# Altium project BlueSat_FlatSat.PrjPCB (part 1 of 2)
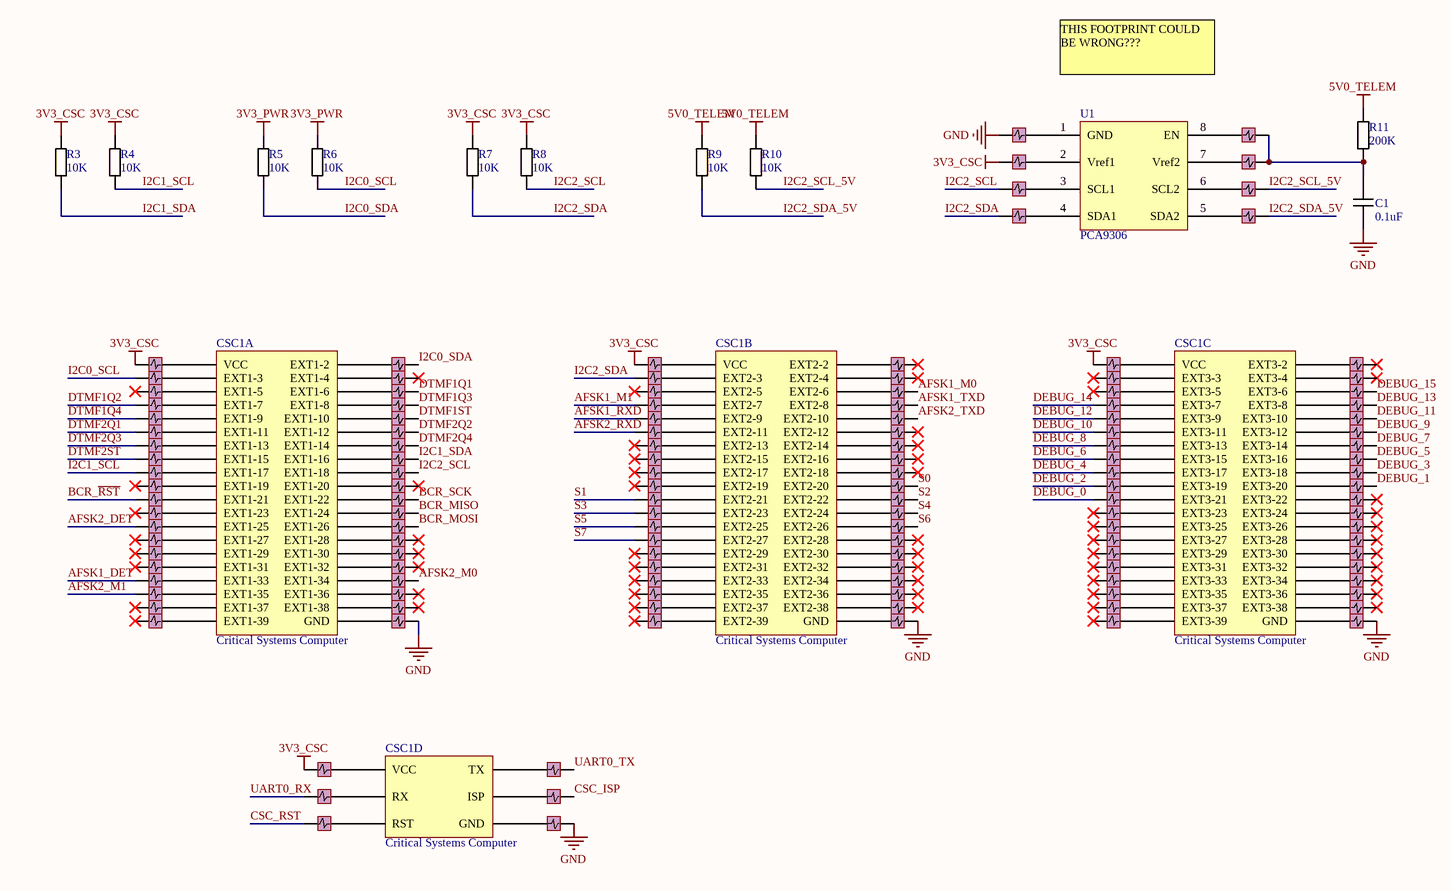
[diagram p0: CRSC0006 CSC Footprint.SchDoc]
3 sheets, 395 parts. Net scope: global (net labels, ports and power ports of the same name join across sheets).
Board files: GENN0007 Flatsat.PcbDoc, CRSC0006 CSC Footprint.PcbDoc, PAYL0007 Beaglebone Footprint.PcbDoc, COMS0007 Communicaitons Footprint.PcbDoc, POWR0011 Regulator Footprints.PcbDoc, POWR0010 BCR and Solar Footprints.PcbDoc
Sheets:
  CRSC0006 CSC Footprint.SchDoc
  COMS0011 Communications Footprints.SchDoc
  GENN0006 LED_INDICATORS.SchDoc

## Sheet CRSC0006 CSC Footprint.SchDoc: Flatsat CSC Footprint
size A3; Engineer: A. Shaw, E. Nafis, C. Brown; DocumentNumber: CRSC0006; SheetNumber: 1; SheetTotal: 6; Description: Critical Systems Computer footprint for Flatsat; Version: 1.0

### Parts
C1  value 0.1uF  [6-0805_M]  (hidden comment: 0805 Cap)
CSC1  Critical Systems Computer  [CSC]  (parts A,B,C,D of 4)
P203  Jumper_Filter  [Jumper_filter]  (value not drawn)
P204  Jumper_Filter  [Jumper_filter]  (value not drawn)
P205  Jumper_Filter  [Jumper_filter]  (value not drawn)
P206  Jumper_Filter  [Jumper_filter]  (value not drawn)
P207  Jumper_Filter  [Jumper_filter]  (value not drawn)
P208  Jumper_Filter  [Jumper_filter]  (value not drawn)
P209  Jumper_Filter  [Jumper_filter]  (value not drawn)
P210  Jumper_Filter  [Jumper_filter]  (value not drawn)
P211  Jumper_Filter  [Jumper_filter]  (value not drawn)
P212  Jumper_Filter  [Jumper_filter]  (value not drawn)
P213  Jumper_Filter  [Jumper_filter]  (value not drawn)
P214  Jumper_Filter  [Jumper_filter]  (value not drawn)
P215  Jumper_Filter  [Jumper_filter]  (value not drawn)
P216  Jumper_Filter  [Jumper_filter]  (value not drawn)
P217  Jumper_Filter  [Jumper_filter]  (value not drawn)
P218  Jumper_Filter  [Jumper_filter]  (value not drawn)
P219  Jumper_Filter  [Jumper_filter]  (value not drawn)
P220  Jumper_Filter  [Jumper_filter]  (value not drawn)
P221  Jumper_Filter  [Jumper_filter]  (value not drawn)
P222  Jumper_Filter  [Jumper_filter]  (value not drawn)
P223  Jumper_Filter  [Jumper_filter]  (value not drawn)
P224  Jumper_Filter  [Jumper_filter]  (value not drawn)
P225  Jumper_Filter  [Jumper_filter]  (value not drawn)
P226  Jumper_Filter  [Jumper_filter]  (value not drawn)
P227  Jumper_Filter  [Jumper_filter]  (value not drawn)
P228  Jumper_Filter  [Jumper_filter]  (value not drawn)
P229  Jumper_Filter  [Jumper_filter]  (value not drawn)
P230  Jumper_Filter  [Jumper_filter]  (value not drawn)
P231  Jumper_Filter  [Jumper_filter]  (value not drawn)
P232  Jumper_Filter  [Jumper_filter]  (value not drawn)
P233  Jumper_Filter  [Jumper_filter]  (value not drawn)
P234  Jumper_Filter  [Jumper_filter]  (value not drawn)
P235  Jumper_Filter  [Jumper_filter]  (value not drawn)
P236  Jumper_Filter  [Jumper_filter]  (value not drawn)
P237  Jumper_Filter  [Jumper_filter]  (value not drawn)
P238  Jumper_Filter  [Jumper_filter]  (value not drawn)
P239  Jumper_Filter  [Jumper_filter]  (value not drawn)
P240  Jumper_Filter  [Jumper_filter]  (value not drawn)
P241  Jumper_Filter  [Jumper_filter]  (value not drawn)
P242  Jumper_Filter  [Jumper_filter]  (value not drawn)
P243  Jumper_Filter  [Jumper_filter]  (value not drawn)
P244  Jumper_Filter  [Jumper_filter]  (value not drawn)
P245  Jumper_Filter  [Jumper_filter]  (value not drawn)
P246  Jumper_Filter  [Jumper_filter]  (value not drawn)
P247  Jumper_Filter  [Jumper_filter]  (value not drawn)
P248  Jumper_Filter  [Jumper_filter]  (value not drawn)
P249  Jumper_Filter  [Jumper_filter]  (value not drawn)
P250  Jumper_Filter  [Jumper_filter]  (value not drawn)
P251  Jumper_Filter  [Jumper_filter]  (value not drawn)
P252  Jumper_Filter  [Jumper_filter]  (value not drawn)
P253  Jumper_Filter  [Jumper_filter]  (value not drawn)
P254  Jumper_Filter  [Jumper_filter]  (value not drawn)
P255  Jumper_Filter  [Jumper_filter]  (value not drawn)
P256  Jumper_Filter  [Jumper_filter]  (value not drawn)
P257  Jumper_Filter  [Jumper_filter]  (value not drawn)
P258  Jumper_Filter  [Jumper_filter]  (value not drawn)
P259  Jumper_Filter  [Jumper_filter]  (value not drawn)
P260  Jumper_Filter  [Jumper_filter]  (value not drawn)
P261  Jumper_Filter  [Jumper_filter]  (value not drawn)
P262  Jumper_Filter  [Jumper_filter]  (value not drawn)
P263  Jumper_Filter  [Jumper_filter]  (value not drawn)
P264  Jumper_Filter  [Jumper_filter]  (value not drawn)
P265  Jumper_Filter  [Jumper_filter]  (value not drawn)
P266  Jumper_Filter  [Jumper_filter]  (value not drawn)
P267  Jumper_Filter  [Jumper_filter]  (value not drawn)
P268  Jumper_Filter  [Jumper_filter]  (value not drawn)
P269  Jumper_Filter  [Jumper_filter]  (value not drawn)
P270  Jumper_Filter  [Jumper_filter]  (value not drawn)
P271  Jumper_Filter  [Jumper_filter]  (value not drawn)
P272  Jumper_Filter  [Jumper_filter]  (value not drawn)
P273  Jumper_Filter  [Jumper_filter]  (value not drawn)
P274  Jumper_Filter  [Jumper_filter]  (value not drawn)
P275  Jumper_Filter  [Jumper_filter]  (value not drawn)
P276  Jumper_Filter  [Jumper_filter]  (value not drawn)
P277  Jumper_Filter  [Jumper_filter]  (value not drawn)
P278  Jumper_Filter  [Jumper_filter]  (value not drawn)
P279  Jumper_Filter  [Jumper_filter]  (value not drawn)
P280  Jumper_Filter  [Jumper_filter]  (value not drawn)
P281  Jumper_Filter  [Jumper_filter]  (value not drawn)
P282  Jumper_Filter  [Jumper_filter]  (value not drawn)
P283  Jumper_Filter  [Jumper_filter]  (value not drawn)
P284  Jumper_Filter  [Jumper_filter]  (value not drawn)
P285  Jumper_Filter  [Jumper_filter]  (value not drawn)
P286  Jumper_Filter  [Jumper_filter]  (value not drawn)
P287  Jumper_Filter  [Jumper_filter]  (value not drawn)
P288  Jumper_Filter  [Jumper_filter]  (value not drawn)
P289  Jumper_Filter  [Jumper_filter]  (value not drawn)
P290  Jumper_Filter  [Jumper_filter]  (value not drawn)
P291  Jumper_Filter  [Jumper_filter]  (value not drawn)
P292  Jumper_Filter  [Jumper_filter]  (value not drawn)
P293  Jumper_Filter  [Jumper_filter]  (value not drawn)
P294  Jumper_Filter  [Jumper_filter]  (value not drawn)
P295  Jumper_Filter  [Jumper_filter]  (value not drawn)
P296  Jumper_Filter  [Jumper_filter]  (value not drawn)
P297  Jumper_Filter  [Jumper_filter]  (value not drawn)
P298  Jumper_Filter  [Jumper_filter]  (value not drawn)
P299  Jumper_Filter  [Jumper_filter]  (value not drawn)
P300  Jumper_Filter  [Jumper_filter]  (value not drawn)
P301  Jumper_Filter  [Jumper_filter]  (value not drawn)
P302  Jumper_Filter  [Jumper_filter]  (value not drawn)
P303  Jumper_Filter  [Jumper_filter]  (value not drawn)
P304  Jumper_Filter  [Jumper_filter]  (value not drawn)
P305  Jumper_Filter  [Jumper_filter]  (value not drawn)
P306  Jumper_Filter  [Jumper_filter]  (value not drawn)
P307  Jumper_Filter  [Jumper_filter]  (value not drawn)
P308  Jumper_Filter  [Jumper_filter]  (value not drawn)
P309  Jumper_Filter  [Jumper_filter]  (value not drawn)
P310  Jumper_Filter  [Jumper_filter]  (value not drawn)
P311  Jumper_Filter  [Jumper_filter]  (value not drawn)
P312  Jumper_Filter  [Jumper_filter]  (value not drawn)
P313  Jumper_Filter  [Jumper_filter]  (value not drawn)
P314  Jumper_Filter  [Jumper_filter]  (value not drawn)
P315  Jumper_Filter  [Jumper_filter]  (value not drawn)
P316  Jumper_Filter  [Jumper_filter]  (value not drawn)
P317  Jumper_Filter  [Jumper_filter]  (value not drawn)
P318  Jumper_Filter  [Jumper_filter]  (value not drawn)
P319  Jumper_Filter  [Jumper_filter]  (value not drawn)
P320  Jumper_Filter  [Jumper_filter]  (value not drawn)
P321  Jumper_Filter  [Jumper_filter]  (value not drawn)
P322  Jumper_Filter  [Jumper_filter]  (value not drawn)
P323  Jumper_Filter  [Jumper_filter]  (value not drawn)
P324  Jumper_Filter  [Jumper_filter]  (value not drawn)
P325  Jumper_Filter  [Jumper_filter]  (value not drawn)
P326  Jumper_Filter  [Jumper_filter]  (value not drawn)
P327  Jumper_Filter  [Jumper_filter]  (value not drawn)
P328  Jumper_Filter  [Jumper_filter]  (value not drawn)
P329  Jumper_Filter  [Jumper_filter]  (value not drawn)
P330  Jumper_Filter  [Jumper_filter]  (value not drawn)
P331  Jumper_Filter  [Jumper_filter]  (value not drawn)
P332  Jumper_Filter  [Jumper_filter]  (value not drawn)
P333  Jumper_Filter  [Jumper_filter]  (value not drawn)
P334  Jumper_Filter  [Jumper_filter]  (value not drawn)
P335  Jumper_Filter  [Jumper_filter]  (value not drawn)
P336  Jumper_Filter  [Jumper_filter]  (value not drawn)
R3  value 10K  [6-0805_M]  (hidden comment: 1206 Resistor)
R4  value 10K  [6-0805_M]  (hidden comment: 1206 Resistor)
R5  value 10K  [6-0805_M]  (hidden comment: 1206 Resistor)
R6  value 10K  [6-0805_M]  (hidden comment: 1206 Resistor)
R7  value 10K  [6-0805_M]  (hidden comment: 1206 Resistor)
R8  value 10K  [6-0805_M]  (hidden comment: 1206 Resistor)
R9  value 10K  [6-0805_M]  (hidden comment: 1206 Resistor)
R10  value 10K  [6-0805_M]  (hidden comment: 1206 Resistor)
R11  value 200K  [6-0805_M]  (hidden comment: 1206 Resistor)
U1  PCA9306  [TSSOP50P310X90-8N]

### Nets
3V3_CSC: P203.1 P223.1 P249.1 P290.1 P293.1 R3.1 R4.1 R7.1 R8.1
3V3_PWR: R5.1 R6.1
5V0_TELEM: R9.1 R10.1 R11.1
GND: C1.1 P203.3 P204.3 P205.3 P206.3 P207.3 P208.3 P209.3 P210.3 P211.3 P212.3 P213.3 P214.3 P215.3 P216.3 P217.3 P218.3 P219.3 P220.3 P221.3 P222.3 P223.3 P224.3 P225.3 P226.3 P227.3 P228.3 P229.3 P230.3 P231.3 P232.3 P233.3 P234.3 P235.3 P236.3 P237.3 P238.3 P239.3 P240.3 P241.3 P242.3 P243.3 P244.3 P245.1 P245.3 P246.3 P247.3 P248.1 P248.3 P249.3 P250.3 P251.3 P252.3 P253.3 P254.3 P255.3 P256.3 P257.3 P258.3 P259.3 P260.3 P261.3 P262.3 P263.3 P264.3 P265.3 P266.3 P267.3 P268.3 P269.3 P270.3 P271.3 P272.3 P273.3 P274.3 P275.3 P276.3 P277.3 P278.3 P279.3 P280.3 P281.3 P282.3 P283.3 P284.3 P285.3 P286.3 P287.3 P288.1 P288.3 P289.1 P289.3 P290.3 P291.3 P292.3 P293.3 P294.3 P295.3 P296.3 P297.3 P298.3 P299.3 P300.3 P301.3 P302.3 P303.3 P304.3 P305.3 P306.3 P307.3 P308.3 P309.3 P310.3 P311.3 P312.3 P313.3 P314.3 P315.3 P316.3 P317.3 P318.3 P319.3 P320.3 P321.3 P322.3 P323.3 P324.3 P325.3 P326.3 P327.3 P328.3 P329.3 P330.3 P331.3 P332.3 P333.3 P334.3 P335.3 P336.1 P336.3
AFSK1_DET: P219.1
AFSK1_M0: P271.1
AFSK1_M1: P252.1
AFSK1_RXD: P253.1
AFSK1_TXD: P272.1
AFSK2_DET: P215.1
AFSK2_M0: P242.1
AFSK2_M1: P220.1
AFSK2_RXD: P254.1
AFSK2_TXD: P273.1
BCR_MISO: P237.1
BCR_MOSI: P238.1
BCR_~{RST}: P213.1
BCR_SCK: P236.1
CSC_ISP: P247.1
CSC_RST: P225.1
DEBUG_0: P303.1
DEBUG_1: P326.1
DEBUG_2: P302.1
DEBUG_3: P325.1
DEBUG_4: P301.1
DEBUG_5: P324.1
DEBUG_6: P300.1
DEBUG_7: P323.1
DEBUG_8: P299.1
DEBUG_9: P322.1
DEBUG_10: P298.1
DEBUG_11: P321.1
DEBUG_12: P297.1
DEBUG_13: P320.1
DEBUG_14: P296.1
DEBUG_15: P319.1
DTMF1Q1: P228.1
DTMF1Q2: P206.1
DTMF1Q3: P229.1
DTMF1Q4: P207.1
DTMF1ST: P230.1
DTMF2Q1: P208.1
DTMF2Q2: P231.1
DTMF2Q3: P209.1
DTMF2Q4: P232.1
DTMF2ST: P210.1
I2C0_SCL: P204.1 R6.2
I2C0_SDA: P226.1 R5.2
I2C1_SCL: P211.1 R4.2
I2C1_SDA: P233.1 R3.2
I2C2_SCL: P234.1 P291.1 R8.2
I2C2_SCL_5V: P315.1 R10.2
I2C2_SDA: P250.1 P292.1 R7.2
I2C2_SDA_5V: P316.1 R9.2
S0: P278.1
S1: P259.1
S2: P279.1
S3: P260.1
S4: P280.1
S5: P261.1
S6: P281.1
S7: P262.1
UART0_RX: P224.1
UART0_TX: P246.1
NetC1_2: C1.2 P313.1 P314.1 R11.2
NetCSC1_C1_1: CSC1.C1_1(VCC) P203.2
NetCSC1_C1_2: CSC1.C1_2(EXT1-2) P226.2
NetCSC1_C1_3: CSC1.C1_3(EXT1-3) P204.2
NetCSC1_C1_4: CSC1.C1_4(EXT1-4) P227.2
NetCSC1_C1_5: CSC1.C1_5(EXT1-5) P205.2
NetCSC1_C1_6: CSC1.C1_6(EXT1-6) P228.2
NetCSC1_C1_7: CSC1.C1_7(EXT1-7) P206.2
NetCSC1_C1_8: CSC1.C1_8(EXT1-8) P229.2
NetCSC1_C1_9: CSC1.C1_9(EXT1-9) P207.2
NetCSC1_C1_10: CSC1.C1_10(EXT1-10) P230.2
NetCSC1_C1_11: CSC1.C1_11(EXT1-11) P208.2
NetCSC1_C1_12: CSC1.C1_12(EXT1-12) P231.2
NetCSC1_C1_13: CSC1.C1_13(EXT1-13) P209.2
NetCSC1_C1_14: CSC1.C1_14(EXT1-14) P232.2
NetCSC1_C1_15: CSC1.C1_15(EXT1-15) P210.2
NetCSC1_C1_16: CSC1.C1_16(EXT1-16) P233.2
NetCSC1_C1_17: CSC1.C1_17(EXT1-17) P211.2
NetCSC1_C1_18: CSC1.C1_18(EXT1-18) P234.2
NetCSC1_C1_19: CSC1.C1_19(EXT1-19) P212.2
NetCSC1_C1_20: CSC1.C1_20(EXT1-20) P235.2
NetCSC1_C1_21: CSC1.C1_21(EXT1-21) P213.2
NetCSC1_C1_22: CSC1.C1_22(EXT1-22) P236.2
NetCSC1_C1_23: CSC1.C1_23(EXT1-23) P214.2
NetCSC1_C1_24: CSC1.C1_24(EXT1-24) P237.2
NetCSC1_C1_25: CSC1.C1_25(EXT1-25) P215.2
NetCSC1_C1_26: CSC1.C1_26(EXT1-26) P238.2
NetCSC1_C1_27: CSC1.C1_27(EXT1-27) P216.2
NetCSC1_C1_28: CSC1.C1_28(EXT1-28) P239.2
NetCSC1_C1_29: CSC1.C1_29(EXT1-29) P217.2
NetCSC1_C1_30: CSC1.C1_30(EXT1-30) P240.2
NetCSC1_C1_31: CSC1.C1_31(EXT1-31) P218.2
NetCSC1_C1_32: CSC1.C1_32(EXT1-32) P241.2
NetCSC1_C1_33: CSC1.C1_33(EXT1-33) P219.2
NetCSC1_C1_34: CSC1.C1_34(EXT1-34) P242.2
NetCSC1_C1_35: CSC1.C1_35(EXT1-35) P220.2
NetCSC1_C1_36: CSC1.C1_36(EXT1-36) P243.2
NetCSC1_C1_37: CSC1.C1_37(EXT1-37) P221.2
NetCSC1_C1_38: CSC1.C1_38(EXT1-38) P244.2
NetCSC1_C1_39: CSC1.C1_39(EXT1-39) P222.2
NetCSC1_C1_40: CSC1.C1_40(GND) P245.2
NetCSC1_C2_1: CSC1.C2_1(VCC) P249.2
NetCSC1_C2_2: CSC1.C2_2(EXT2-2) P269.2
NetCSC1_C2_3: CSC1.C2_3(EXT2-3) P250.2
NetCSC1_C2_4: CSC1.C2_4(EXT2-4) P270.2
NetCSC1_C2_5: CSC1.C2_5(EXT2-5) P251.2
NetCSC1_C2_6: CSC1.C2_6(EXT2-6) P271.2
NetCSC1_C2_7: CSC1.C2_7(EXT2-7) P252.2
NetCSC1_C2_8: CSC1.C2_8(EXT2-8) P272.2
NetCSC1_C2_9: CSC1.C2_9(EXT2-9) P253.2
NetCSC1_C2_10: CSC1.C2_10(EXT2-10) P273.2
NetCSC1_C2_11: CSC1.C2_11(EXT2-11) P254.2
NetCSC1_C2_12: CSC1.C2_12(EXT2-12) P274.2
NetCSC1_C2_13: CSC1.C2_13(EXT2-13) P255.2
NetCSC1_C2_14: CSC1.C2_14(EXT2-14) P275.2
NetCSC1_C2_15: CSC1.C2_15(EXT2-15) P256.2
NetCSC1_C2_16: CSC1.C2_16(EXT2-16) P276.2
NetCSC1_C2_17: CSC1.C2_17(EXT2-17) P257.2
NetCSC1_C2_18: CSC1.C2_18(EXT2-18) P277.2
NetCSC1_C2_19: CSC1.C2_19(EXT2-19) P258.2
NetCSC1_C2_20: CSC1.C2_20(EXT2-20) P278.2
NetCSC1_C2_21: CSC1.C2_21(EXT2-21) P259.2
NetCSC1_C2_22: CSC1.C2_22(EXT2-22) P279.2
NetCSC1_C2_23: CSC1.C2_23(EXT2-23) P260.2
NetCSC1_C2_24: CSC1.C2_24(EXT2-24) P280.2
NetCSC1_C2_25: CSC1.C2_25(EXT2-25) P261.2
NetCSC1_C2_26: CSC1.C2_26(EXT2-26) P281.2
NetCSC1_C2_27: CSC1.C2_27(EXT2-27) P262.2
NetCSC1_C2_28: CSC1.C2_28(EXT2-28) P282.2
NetCSC1_C2_29: CSC1.C2_29(EXT2-29) P263.2
NetCSC1_C2_30: CSC1.C2_30(EXT2-30) P283.2
NetCSC1_C2_31: CSC1.C2_31(EXT2-31) P264.2
NetCSC1_C2_32: CSC1.C2_32(EXT2-32) P284.2
NetCSC1_C2_33: CSC1.C2_33(EXT2-33) P265.2
NetCSC1_C2_34: CSC1.C2_34(EXT2-34) P285.2
NetCSC1_C2_35: CSC1.C2_35(EXT2-35) P266.2
NetCSC1_C2_36: CSC1.C2_36(EXT2-36) P286.2
NetCSC1_C2_37: CSC1.C2_37(EXT2-37) P267.2
NetCSC1_C2_38: CSC1.C2_38(EXT2-38) P287.2
NetCSC1_C2_39: CSC1.C2_39(EXT2-39) P268.2
NetCSC1_C2_40: CSC1.C2_40(GND) P288.2
NetCSC1_C3_1: CSC1.C3_1(VCC) P293.2
NetCSC1_C3_2: CSC1.C3_2(EXT3-2) P317.2
NetCSC1_C3_3: CSC1.C3_3(EXT3-3) P294.2
NetCSC1_C3_4: CSC1.C3_4(EXT3-4) P318.2
NetCSC1_C3_5: CSC1.C3_5(EXT3-5) P295.2
NetCSC1_C3_6: CSC1.C3_6(EXT3-6) P319.2
NetCSC1_C3_7: CSC1.C3_7(EXT3-7) P296.2
NetCSC1_C3_8: CSC1.C3_8(EXT3-8) P320.2
NetCSC1_C3_9: CSC1.C3_9(EXT3-9) P297.2
NetCSC1_C3_10: CSC1.C3_10(EXT3-10) P321.2
NetCSC1_C3_11: CSC1.C3_11(EXT3-11) P298.2
NetCSC1_C3_12: CSC1.C3_12(EXT3-12) P322.2
NetCSC1_C3_13: CSC1.C3_13(EXT3-13) P299.2
NetCSC1_C3_14: CSC1.C3_14(EXT3-14) P323.2
NetCSC1_C3_15: CSC1.C3_15(EXT3-15) P300.2
NetCSC1_C3_16: CSC1.C3_16(EXT3-16) P324.2
NetCSC1_C3_17: CSC1.C3_17(EXT3-17) P301.2
NetCSC1_C3_18: CSC1.C3_18(EXT3-18) P325.2
NetCSC1_C3_19: CSC1.C3_19(EXT3-19) P302.2
NetCSC1_C3_20: CSC1.C3_20(EXT3-20) P326.2
NetCSC1_C3_21: CSC1.C3_21(EXT3-21) P303.2
NetCSC1_C3_22: CSC1.C3_22(EXT3-22) P327.2
NetCSC1_C3_23: CSC1.C3_23(EXT3-23) P304.2
NetCSC1_C3_24: CSC1.C3_24(EXT3-24) P328.2
NetCSC1_C3_25: CSC1.C3_25(EXT3-25) P305.2
NetCSC1_C3_26: CSC1.C3_26(EXT3-26) P329.2
NetCSC1_C3_27: CSC1.C3_27(EXT3-27) P306.2
NetCSC1_C3_28: CSC1.C3_28(EXT3-28) P330.2
NetCSC1_C3_29: CSC1.C3_29(EXT3-29) P307.2
NetCSC1_C3_30: CSC1.C3_30(EXT3-30) P331.2
NetCSC1_C3_31: CSC1.C3_31(EXT3-31) P308.2
NetCSC1_C3_32: CSC1.C3_32(EXT3-32) P332.2
NetCSC1_C3_33: CSC1.C3_33(EXT3-33) P309.2
NetCSC1_C3_34: CSC1.C3_34(EXT3-34) P333.2
NetCSC1_C3_35: CSC1.C3_35(EXT3-35) P310.2
NetCSC1_C3_36: CSC1.C3_36(EXT3-36) P334.2
NetCSC1_C3_37: CSC1.C3_37(EXT3-37) P311.2
NetCSC1_C3_38: CSC1.C3_38(EXT3-38) P335.2
NetCSC1_C3_39: CSC1.C3_39(EXT3-39) P312.2
NetCSC1_C3_40: CSC1.C3_40(GND) P336.2
NetCSC1_ISP1: CSC1.ISP1(VCC) P223.2
NetCSC1_ISP2: CSC1.ISP2(RX) P224.2
NetCSC1_ISP3: CSC1.ISP3(RST) P225.2
NetCSC1_ISP4: CSC1.ISP4(TX) P246.2
NetCSC1_ISP5: CSC1.ISP5(ISP) P247.2
NetCSC1_ISP6: CSC1.ISP6(GND) P248.2
NetP289_2: P289.2 U1.1(GND)
NetP290_2: P290.2 U1.2(Vref1)
NetP291_2: P291.2 U1.3(SCL1)
NetP292_2: P292.2 U1.4(SDA1)
NetP313_2: P313.2 U1.8(EN)
NetP314_2: P314.2 U1.7(Vref2)
NetP315_2: P315.2 U1.6(SCL2)
NetP316_2: P316.2 U1.5(SDA2)

Not connected (* = marked no-connect by the designer): P205 1*; P212 1*; P214 1*; P216 1*; P217 1*; P218 1*; P221 1*; P222 1*; P227 1*; P235 1*; P239 1*; P240 1*; P241 1*; P243 1*; P244 1*; P251 1*; P255 1*; P256 1*; P257 1*; P258 1*; P263 1*; P264 1*; P265 1*; P266 1*; P267 1*; P268 1*; P269 1*; P270 1*; P274 1*; P275 1*; P276 1*; P277 1*; P282 1*; P283 1*; P284 1*; P285 1*; P286 1*; P287 1*; P294 1*; P295 1*; P304 1*; P305 1*; P306 1*; P307 1*; P308 1*; P309 1*; P310 1*; P311 1*; P312 1*; P317 1*; P318 1*; P327 1*; P328 1*; P329 1*; P330 1*; P331 1*; P332 1*; P333 1*; P334 1*; P335 1*

### Notes on the sheet
- THIS FOOTPRINT COULD BE WRONG???
- Title
- Description:
- Size:
- Author:
- Date:
- A3
- Time:
- Version
- Sheet:
- Drawing No.:
- of
- File:

### Library data of the parts
C1 = 0805 MLCC - X7R, 10%
CSC1 = CSC
R3-R11 = 1206 Thick Film Resistor 1%

## Sheet COMS0011 Communications Footprints.SchDoc: Flatsat Communications Footprints
size A3; Engineer: A. Shaw, E.Nafis, C. Brown; DocumentNumber: COMS0011; SheetNumber: 3; SheetTotal: 6; Description: Footprints for Communication boards on Flatsat; Version: 1.0
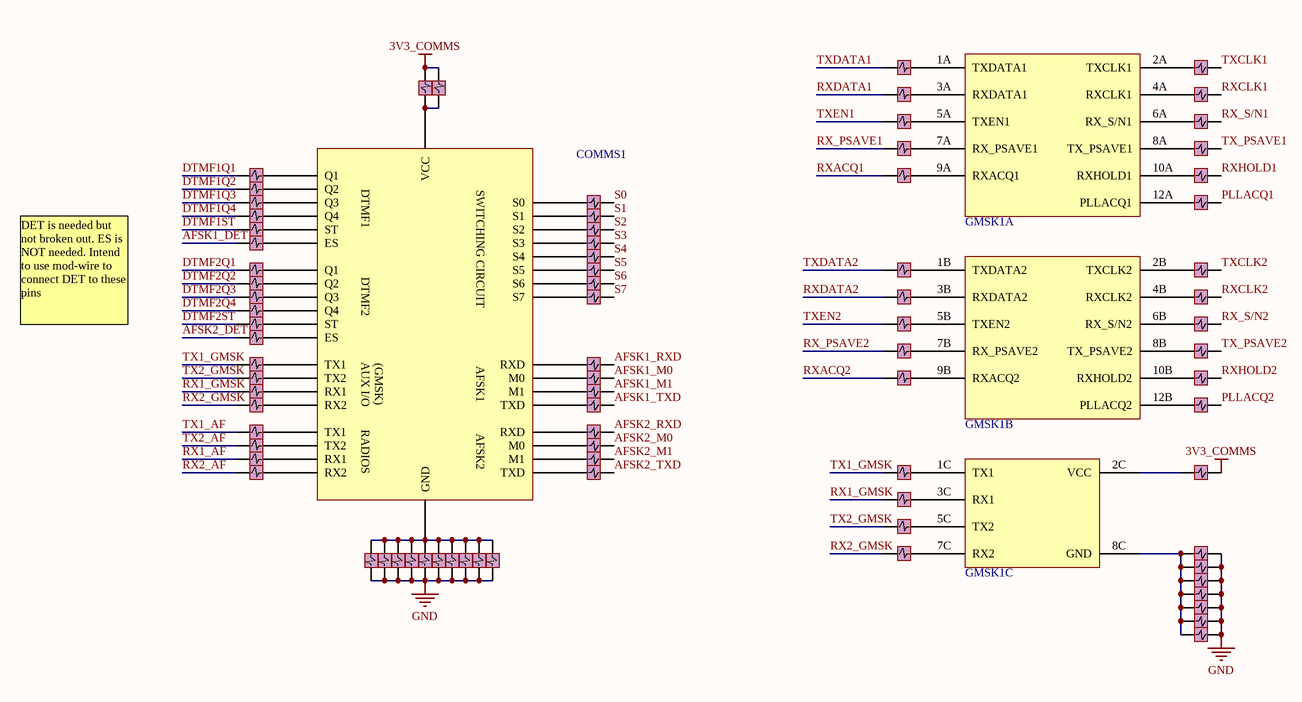
[diagram p1: COMS0011 Communications Footprints.SchDoc]

### Parts
COMMS1  COMMS  [Communications]  (value not drawn)
GMSK1  GMSK  [GMSK]  (value not drawn)  (parts A,B,C of 3)
P103  Jumper_Filter  [Jumper_filter]  (value not drawn)
P104  Jumper_Filter  [Jumper_filter]  (value not drawn)
P105  Jumper_Filter  [Jumper_filter]  (value not drawn)
P106  Jumper_Filter  [Jumper_filter]  (value not drawn)
P107  Jumper_Filter  [Jumper_filter]  (value not drawn)
P108  Jumper_Filter  [Jumper_filter]  (value not drawn)
P109  Jumper_Filter  [Jumper_filter]  (value not drawn)
P110  Jumper_Filter  [Jumper_filter]  (value not drawn)
P111  Jumper_Filter  [Jumper_filter]  (value not drawn)
P112  Jumper_Filter  [Jumper_filter]  (value not drawn)
P113  Jumper_Filter  [Jumper_filter]  (value not drawn)
P114  Jumper_Filter  [Jumper_filter]  (value not drawn)
P115  Jumper_Filter  [Jumper_filter]  (value not drawn)
P116  Jumper_Filter  [Jumper_filter]  (value not drawn)
P117  Jumper_Filter  [Jumper_filter]  (value not drawn)
P118  Jumper_Filter  [Jumper_filter]  (value not drawn)
P119  Jumper_Filter  [Jumper_filter]  (value not drawn)
P120  Jumper_Filter  [Jumper_filter]  (value not drawn)
P121  Jumper_Filter  [Jumper_filter]  (value not drawn)
P122  Jumper_Filter  [Jumper_filter]  (value not drawn)
P123  Jumper_Filter  [Jumper_filter]  (value not drawn)
P124  Jumper_Filter  [Jumper_filter]  (value not drawn)
P125  Jumper_Filter  [Jumper_filter]  (value not drawn)
P126  Jumper_Filter  [Jumper_filter]  (value not drawn)
P127  Jumper_Filter  [Jumper_filter]  (value not drawn)
P128  Jumper_Filter  [Jumper_filter]  (value not drawn)
P129  Jumper_Filter  [Jumper_filter]  (value not drawn)
P130  Jumper_Filter  [Jumper_filter]  (value not drawn)
P131  Jumper_Filter  [Jumper_filter]  (value not drawn)
P132  Jumper_Filter  [Jumper_filter]  (value not drawn)
P133  Jumper_Filter  [Jumper_filter]  (value not drawn)
P134  Jumper_Filter  [Jumper_filter]  (value not drawn)
P135  Jumper_Filter  [Jumper_filter]  (value not drawn)
P136  Jumper_Filter  [Jumper_filter]  (value not drawn)
P137  Jumper_Filter  [Jumper_filter]  (value not drawn)
P138  Jumper_Filter  [Jumper_filter]  (value not drawn)
P139  Jumper_Filter  [Jumper_filter]  (value not drawn)
P140  Jumper_Filter  [Jumper_filter]  (value not drawn)
P141  Jumper_Filter  [Jumper_filter]  (value not drawn)
P142  Jumper_Filter  [Jumper_filter]  (value not drawn)
P143  Jumper_Filter  [Jumper_filter]  (value not drawn)
P144  Jumper_Filter  [Jumper_filter]  (value not drawn)
P145  Jumper_Filter  [Jumper_filter]  (value not drawn)
P146  Jumper_Filter  [Jumper_filter]  (value not drawn)
P147  Jumper_Filter  [Jumper_filter]  (value not drawn)
P148  Jumper_Filter  [Jumper_filter]  (value not drawn)
P149  Jumper_Filter  [Jumper_filter]  (value not drawn)
P150  Jumper_Filter  [Jumper_filter]  (value not drawn)
P151  Jumper_Filter  [Jumper_filter]  (value not drawn)
P152  Jumper_Filter  [Jumper_filter]  (value not drawn)
P153  Jumper_Filter  [Jumper_filter]  (value not drawn)
P154  Jumper_Filter  [Jumper_filter]  (value not drawn)
P155  Jumper_Filter  [Jumper_filter]  (value not drawn)
P156  Jumper_Filter  [Jumper_filter]  (value not drawn)
P157  Jumper_Filter  [Jumper_filter]  (value not drawn)
P158  Jumper_Filter  [Jumper_filter]  (value not drawn)
P159  Jumper_Filter  [Jumper_filter]  (value not drawn)
P160  Jumper_Filter  [Jumper_filter]  (value not drawn)
P161  Jumper_Filter  [Jumper_filter]  (value not drawn)
P162  Jumper_Filter  [Jumper_filter]  (value not drawn)
P163  Jumper_Filter  [Jumper_filter]  (value not drawn)
P164  Jumper_Filter  [Jumper_filter]  (value not drawn)
P165  Jumper_Filter  [Jumper_filter]  (value not drawn)
P166  Jumper_Filter  [Jumper_filter]  (value not drawn)
P167  Jumper_Filter  [Jumper_filter]  (value not drawn)
P168  Jumper_Filter  [Jumper_filter]  (value not drawn)
P169  Jumper_Filter  [Jumper_filter]  (value not drawn)
P170  Jumper_Filter  [Jumper_filter]  (value not drawn)
P171  Jumper_Filter  [Jumper_filter]  (value not drawn)
P172  Jumper_Filter  [Jumper_filter]  (value not drawn)
P173  Jumper_Filter  [Jumper_filter]  (value not drawn)
P174  Jumper_Filter  [Jumper_filter]  (value not drawn)
P175  Jumper_Filter  [Jumper_filter]  (value not drawn)
P176  Jumper_Filter  [Jumper_filter]  (value not drawn)
P177  Jumper_Filter  [Jumper_filter]  (value not drawn)
P178  Jumper_Filter  [Jumper_filter]  (value not drawn)
P179  Jumper_Filter  [Jumper_filter]  (value not drawn)
P180  Jumper_Filter  [Jumper_filter]  (value not drawn)
P181  Jumper_Filter  [Jumper_filter]  (value not drawn)
P182  Jumper_Filter  [Jumper_filter]  (value not drawn)
P183  Jumper_Filter  [Jumper_filter]  (value not drawn)
P184  Jumper_Filter  [Jumper_filter]  (value not drawn)

### Nets
3V3_COMMS: P127.1 P129.1 P177.1
GND: P103.3 P104.3 P105.3 P106.3 P107.3 P108.3 P109.3 P110.3 P111.3 P112.3 P113.3 P114.3 P115.3 P116.3 P117.3 P118.3 P119.3 P120.3 P121.3 P122.3 P123.1 P123.3 P124.1 P124.3 P125.1 P125.3 P126.1 P126.3 P127.3 P128.1 P128.3 P129.3 P130.1 P130.3 P131.1 P131.3 P132.1 P132.3 P133.1 P133.3 P134.1 P134.3 P135.3 P136.3 P137.3 P138.3 P139.3 P140.3 P141.3 P142.3 P143.3 P144.3 P145.3 P146.3 P147.3 P148.3 P149.3 P150.3 P151.3 P152.3 P153.3 P154.3 P155.3 P156.3 P157.3 P158.3 P159.3 P160.3 P161.3 P162.3 P163.3 P164.3 P165.3 P166.3 P167.3 P168.3 P169.3 P170.3 P171.3 P172.3 P173.3 P174.3 P175.3 P176.3 P177.3 P178.1 P178.3 P179.1 P179.3 P180.1 P180.3 P181.1 P181.3 P182.1 P182.3 P183.1 P183.3 P184.1 P184.3
AFSK1_DET: P108.1
AFSK1_M0: P144.1
AFSK1_M1: P145.1
AFSK1_RXD: P143.1
AFSK1_TXD: P146.1
AFSK2_DET: P114.1
AFSK2_M0: P148.1
AFSK2_M1: P149.1
AFSK2_RXD: P147.1
AFSK2_TXD: P150.1
DTMF1Q1: P103.1
DTMF1Q2: P104.1
DTMF1Q3: P105.1
DTMF1Q4: P106.1
DTMF1ST: P107.1
DTMF2Q1: P109.1
DTMF2Q2: P110.1
DTMF2Q3: P111.1
DTMF2Q4: P112.1
DTMF2ST: P113.1
PLLACQ1: P170.1
PLLACQ2: P176.1
RX1_AF: P121.1
RX1_GMSK: P117.1 P162.1
RX2_AF: P122.1
RX2_GMSK: P118.1 P164.1
RX_PSAVE1: P154.1
RX_PSAVE2: P159.1
RX_S/N1: P167.1
RX_S/N2: P173.1
RXACQ1: P155.1
RXACQ2: P160.1
RXCLK1: P166.1
RXCLK2: P172.1
RXDATA1: P152.1
RXDATA2: P157.1
RXHOLD1: P169.1
RXHOLD2: P175.1
S0: P135.1
S1: P136.1
S2: P137.1
S3: P138.1
S4: P139.1
S5: P140.1
S6: P141.1
S7: P142.1
TX1_AF: P119.1
TX1_GMSK: P115.1 P161.1
TX2_AF: P120.1
TX2_GMSK: P116.1 P163.1
TX_PSAVE1: P168.1
TX_PSAVE2: P174.1
TXCLK1: P165.1
TXCLK2: P171.1
TXDATA1: P151.1
TXDATA2: P156.1
TXEN1: P153.1
TXEN2: P158.1
NetCOMMS1_AFSK1_M0: COMMS1.AFSK1_M0(M0) P144.2
NetCOMMS1_AFSK1_M1: COMMS1.AFSK1_M1(M1) P145.2
NetCOMMS1_AFSK1_RXD: COMMS1.AFSK1_RXD(RXD) P143.2
NetCOMMS1_AFSK1_TXD: COMMS1.AFSK1_TXD(TXD) P146.2
NetCOMMS1_AFSK2_M0: COMMS1.AFSK2_M0(M0) P148.2
NetCOMMS1_AFSK2_M1: COMMS1.AFSK2_M1(M1) P149.2
NetCOMMS1_AFSK2_RXD: COMMS1.AFSK2_RXD(RXD) P147.2
NetCOMMS1_AFSK2_TXD: COMMS1.AFSK2_TXD(TXD) P150.2
NetCOMMS1_DTMF1_ES: COMMS1.DTMF1_ES(ES) P108.2
NetCOMMS1_DTMF1_Q1: COMMS1.DTMF1_Q1(Q1) P103.2
NetCOMMS1_DTMF1_Q2: COMMS1.DTMF1_Q2(Q2) P104.2
NetCOMMS1_DTMF1_Q3: COMMS1.DTMF1_Q3(Q3) P105.2
NetCOMMS1_DTMF1_Q4: COMMS1.DTMF1_Q4(Q4) P106.2
NetCOMMS1_DTMF1_ST: COMMS1.DTMF1_ST(ST) P107.2
NetCOMMS1_DTMF2_ES: COMMS1.DTMF2_ES(ES) P114.2
NetCOMMS1_DTMF2_Q1: COMMS1.DTMF2_Q1(Q1) P109.2
NetCOMMS1_DTMF2_Q2: COMMS1.DTMF2_Q2(Q2) P110.2
NetCOMMS1_DTMF2_Q3: COMMS1.DTMF2_Q3(Q3) P111.2
NetCOMMS1_DTMF2_Q4: COMMS1.DTMF2_Q4(Q4) P112.2
NetCOMMS1_DTMF2_ST: COMMS1.DTMF2_ST(ST) P113.2
NetCOMMS1_GMSK_RX1: COMMS1.GMSK_RX1(RX1) P117.2
NetCOMMS1_GMSK_RX2: COMMS1.GMSK_RX2(RX2) P118.2
NetCOMMS1_GMSK_TX1: COMMS1.GMSK_TX1(TX1) P115.2
NetCOMMS1_GMSK_TX2: COMMS1.GMSK_TX2(TX2) P116.2
NetCOMMS1_GND: COMMS1.GND P123.2 P124.2 P125.2 P126.2 P128.2 P130.2 P131.2 P132.2 P133.2 P134.2
NetCOMMS1_RX1: COMMS1.RX1 P121.2
NetCOMMS1_RX2: COMMS1.RX2 P122.2
NetCOMMS1_S0: COMMS1.S0 P135.2
NetCOMMS1_S1: COMMS1.S1 P136.2
NetCOMMS1_S2: COMMS1.S2 P137.2
NetCOMMS1_S3: COMMS1.S3 P138.2
NetCOMMS1_S4: COMMS1.S4 P139.2
NetCOMMS1_S5: COMMS1.S5 P140.2
NetCOMMS1_S6: COMMS1.S6 P141.2
NetCOMMS1_S7: COMMS1.S7 P142.2
NetCOMMS1_TX1: COMMS1.TX1 P119.2
NetCOMMS1_TX2: COMMS1.TX2 P120.2
NetCOMMS1_VCC: COMMS1.VCC P127.2 P129.2
NetGMSK1_1A: GMSK1.1A(TXDATA1) P151.2
NetGMSK1_1B: GMSK1.1B(TXDATA2) P156.2
NetGMSK1_1C: GMSK1.1C(TX1) P161.2
NetGMSK1_2A: GMSK1.2A(TXCLK1) P165.2
NetGMSK1_2B: GMSK1.2B(TXCLK2) P171.2
NetGMSK1_2C: GMSK1.2C(VCC) P177.2
NetGMSK1_3A: GMSK1.3A(RXDATA1) P152.2
NetGMSK1_3B: GMSK1.3B(RXDATA2) P157.2
NetGMSK1_3C: GMSK1.3C(RX1) P162.2
NetGMSK1_4A: GMSK1.4A(RXCLK1) P166.2
NetGMSK1_4B: GMSK1.4B(RXCLK2) P172.2
NetGMSK1_5A: GMSK1.5A(TXEN1) P153.2
NetGMSK1_5B: GMSK1.5B(TXEN2) P158.2
NetGMSK1_5C: GMSK1.5C(TX2) P163.2
NetGMSK1_6A: GMSK1.6A(RX_S/N1) P167.2
NetGMSK1_6B: GMSK1.6B(RX_S/N2) P173.2
NetGMSK1_7A: GMSK1.7A(RX_PSAVE1) P154.2
NetGMSK1_7B: GMSK1.7B(RX_PSAVE2) P159.2
NetGMSK1_7C: GMSK1.7C(RX2) P164.2
NetGMSK1_8A: GMSK1.8A(TX_PSAVE1) P168.2
NetGMSK1_8B: GMSK1.8B(TX_PSAVE2) P174.2
NetGMSK1_8C: GMSK1.8C(GND) P178.2 P179.2 P180.2 P181.2 P182.2 P183.2 P184.2
NetGMSK1_9A: GMSK1.9A(RXACQ1) P155.2
NetGMSK1_9B: GMSK1.9B(RXACQ2) P160.2
NetGMSK1_10A: GMSK1.10A(RXHOLD1) P169.2
NetGMSK1_10B: GMSK1.10B(RXHOLD2) P175.2
NetGMSK1_12A: GMSK1.12A(PLLACQ1) P170.2
NetGMSK1_12B: GMSK1.12B(PLLACQ2) P176.2

### Notes on the sheet
- DET is needed but not broken out. ES is NOT needed. Intend to use mod-wire to connect DET to these pins
- Title
- Description:
- Size:
- Author:
- Date:
- A3
- Time:
- Version
- Sheet:
- Drawing No.:
- of
- File:
- (in symbol COMMS) DTMF1; SWITCHING CIRCUIT; DTMF2; AUX I/O; (GMSK); AFSK1; RADIOS; AFSK2

### Library data of the parts
COMMS1 = COMMS: ClassName: COMMSB
GMSK1 = GMSK: ClassName: GMSK
P103-P184 = Jumper_Filter
  P103-P150: ClassName: COMMSB
  P151-P184: ClassName: GMSK